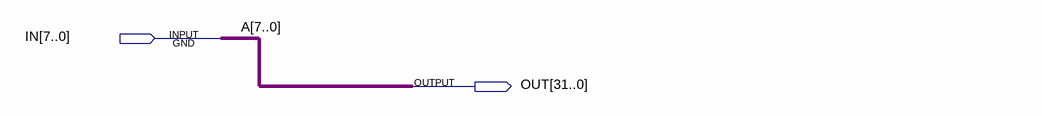
[diagram p0: schematic sheet]
// Quartus schematic signext8_32.bdf as structural Verilog: 0 symbols, 2 pins
module signext8_32 (
  input  [7:0] IN,
  output [31:0] OUT
);


  assign OUT = {{25{IN[7]}}, IN[6:0]};

  // Other names for the same wires on the sheet: A[7:0] = IN
endmodule
